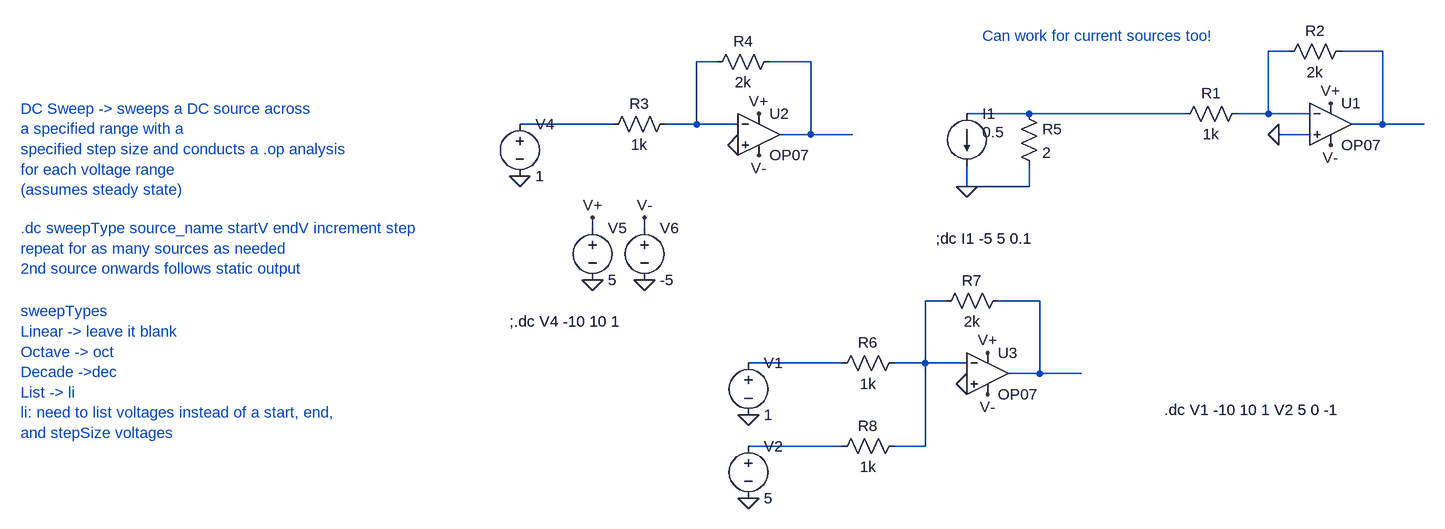
[diagram p0: schematic LTSPICE_Lesson6_DCSweep.asc]
LTSPICE_Lesson6_DCSweep.asc, the LTspice schematic file:
Version 4
SHEET 1 1504 708
WIRE 1136 -144 1104 -144
WIRE 1280 -144 1216 -144
WIRE 256 -128 224 -128
WIRE 400 -128 336 -128
WIRE 736 -48 640 -48
WIRE 976 -48 736 -48
WIRE 1104 -48 1104 -144
WIRE 1104 -48 1056 -48
WIRE 1168 -48 1104 -48
WIRE 96 -32 -48 -32
WIRE 224 -32 224 -128
WIRE 224 -32 176 -32
WIRE 288 -32 224 -32
WIRE 1280 -32 1280 -144
WIRE 1280 -32 1232 -32
WIRE 1344 -32 1280 -32
WIRE 400 -16 400 -128
WIRE 400 -16 352 -16
WIRE 464 -16 400 -16
WIRE 1168 -16 1120 -16
WIRE 640 64 640 32
WIRE 736 64 736 32
WIRE 736 64 640 64
WIRE 64 128 64 112
WIRE 144 128 144 112
WIRE 608 240 576 240
WIRE 752 240 688 240
WIRE 448 336 304 336
WIRE 576 336 576 240
WIRE 576 336 528 336
WIRE 640 336 576 336
WIRE 752 352 752 240
WIRE 752 352 704 352
WIRE 816 352 752 352
WIRE 448 464 304 464
WIRE 576 464 576 336
WIRE 576 464 528 464
FLAG -48 48 0
FLAG 144 208 0
FLAG 64 208 0
FLAG 64 112 V+
FLAG 320 -48 V+
FLAG 144 112 V-
FLAG 320 16 V-
FLAG 1120 -16 0
FLAG 1200 -64 V+
FLAG 1200 0 V-
FLAG 640 64 0
FLAG 288 0 0
FLAG 304 416 0
FLAG 672 320 V+
FLAG 672 384 V-
FLAG 640 368 0
FLAG 304 544 0
SYMBOL voltage -48 -48 R0
WINDOW 123 0 0 Left 0
WINDOW 39 0 0 Left 0
SYMATTR InstName V4
SYMATTR Value 1
SYMBOL res 192 -48 R90
WINDOW 0 0 56 VBottom 2
WINDOW 3 32 56 VTop 2
SYMATTR InstName R3
SYMATTR Value 1k
SYMBOL OpAmps\\OP07 320 -80 R0
SYMATTR InstName U2
SYMBOL res 352 -144 R90
WINDOW 0 0 56 VBottom 2
WINDOW 3 32 56 VTop 2
SYMATTR InstName R4
SYMATTR Value 2k
SYMBOL voltage 64 112 R0
WINDOW 123 0 0 Left 0
WINDOW 39 0 0 Left 0
SYMATTR InstName V5
SYMATTR Value 5
SYMBOL voltage 144 112 R0
WINDOW 123 0 0 Left 0
WINDOW 39 0 0 Left 0
SYMATTR InstName V6
SYMATTR Value -5
SYMBOL res 1072 -64 R90
WINDOW 0 0 56 VBottom 2
WINDOW 3 32 56 VTop 2
SYMATTR InstName R1
SYMATTR Value 1k
SYMBOL OpAmps\\OP07 1200 -96 R0
SYMATTR InstName U1
SYMBOL res 1232 -160 R90
WINDOW 0 0 56 VBottom 2
WINDOW 3 32 56 VTop 2
SYMATTR InstName R2
SYMATTR Value 2k
SYMBOL current 640 -48 R0
WINDOW 3 24 28 Left 2
WINDOW 123 0 0 Left 0
WINDOW 39 0 0 Left 0
SYMATTR Value 0.5
SYMATTR InstName I1
SYMBOL res 720 -64 R0
SYMATTR InstName R5
SYMATTR Value 2
SYMBOL voltage 304 320 R0
WINDOW 123 0 0 Left 0
WINDOW 39 0 0 Left 0
SYMATTR InstName V1
SYMATTR Value 1
SYMBOL res 544 320 R90
WINDOW 0 0 56 VBottom 2
WINDOW 3 32 56 VTop 2
SYMATTR InstName R6
SYMATTR Value 1k
SYMBOL OpAmps\\OP07 672 288 R0
SYMATTR InstName U3
SYMBOL res 704 224 R90
WINDOW 0 0 56 VBottom 2
WINDOW 3 32 56 VTop 2
SYMATTR InstName R7
SYMATTR Value 2k
SYMBOL res 544 448 R90
WINDOW 0 0 56 VBottom 2
WINDOW 3 32 56 VTop 2
SYMATTR InstName R8
SYMATTR Value 1k
SYMBOL voltage 304 448 R0
WINDOW 123 0 0 Left 0
WINDOW 39 0 0 Left 0
SYMATTR InstName V2
SYMATTR Value 5
TEXT -64 272 Left 2 !;.dc V4 -10 10 1
TEXT -816 128 Left 2 ;.dc sweepType source_name startV endV increment step\nrepeat for as many sources as needed\n2nd source onwards follows static output
TEXT -816 -56 Left 2 ;DC Sweep -> sweeps a DC source across \na specified range with a \nspecified step size and conducts a .op analysis \nfor each voltage range \n(assumes steady state)
TEXT -816 256 Left 2 ;sweepTypes\nLinear -> leave it blank \nOctave -> oct\nDecade ->dec \nList -> li \nli: need to list voltages instead of a start, end, \nand stepSize voltages
TEXT 664 -168 Left 2 ;Can work for current sources too!
TEXT 592 144 Left 2 !;dc I1 -5 5 0.1
TEXT 944 408 Left 2 !.dc V1 -10 10 1 V2 5 0 -1

The netlist it stands for:
* LTSPICE_Lesson6_DCSweep.asc
V4 N006 0 1
R3 N003 N006 1k
XU2 0 N003 V+ V- N004 LT1001  ; OP07, pins In+ In- V+ V- OUT
R4 N004 N003 2k
V5 V+ 0 5
V6 V- 0 -5
R1 N001 N005 1k
XU1 0 N001 V+ V- N002 LT1001  ; OP07, pins In+ In- V+ V- OUT
R2 N002 N001 2k
I1 N005 0 0.5
R5 N005 0 2
V1 N009 0 1
R6 N007 N009 1k
XU3 0 N007 V+ V- N008 LT1001  ; OP07, pins In+ In- V+ V- OUT
R7 N008 N007 2k
R8 N007 N010 1k
V2 N010 0 5
;.dc V4 -10 10 1
* .dc sweepType source_name startV endV increment step
* repeat for as many sources as needed
* 2nd source onwards follows static output
* DC Sweep -> sweeps a DC source across
* a specified range with a
* specified step size and conducts a .op analysis
* for each voltage range
* (assumes steady state)
* sweepTypes
* Linear -> leave it blank
* Octave -> oct
* Decade ->dec
* List -> li
* li: need to list voltages instead of a start, end,
* and stepSize voltages
* Can work for current sources too!
;dc I1 -5 5 0.1
.dc V1 -10 10 1 V2 5 0 -1
.lib LTC.lib
.backanno
.end